# EasyEDA Pro project ProPrj_F411CEU6_917_2025-09-26.epro

# Schematic Schematic1
Board Name: Board1; Create Date: 2025-09-17; Page Name: P1; Project Name: F411CEU6_917; Schematic Name: Schematic1; Update Date: 2025-09-26; Company: 嘉立创EDA; Page Size: A4; Version: V1.0
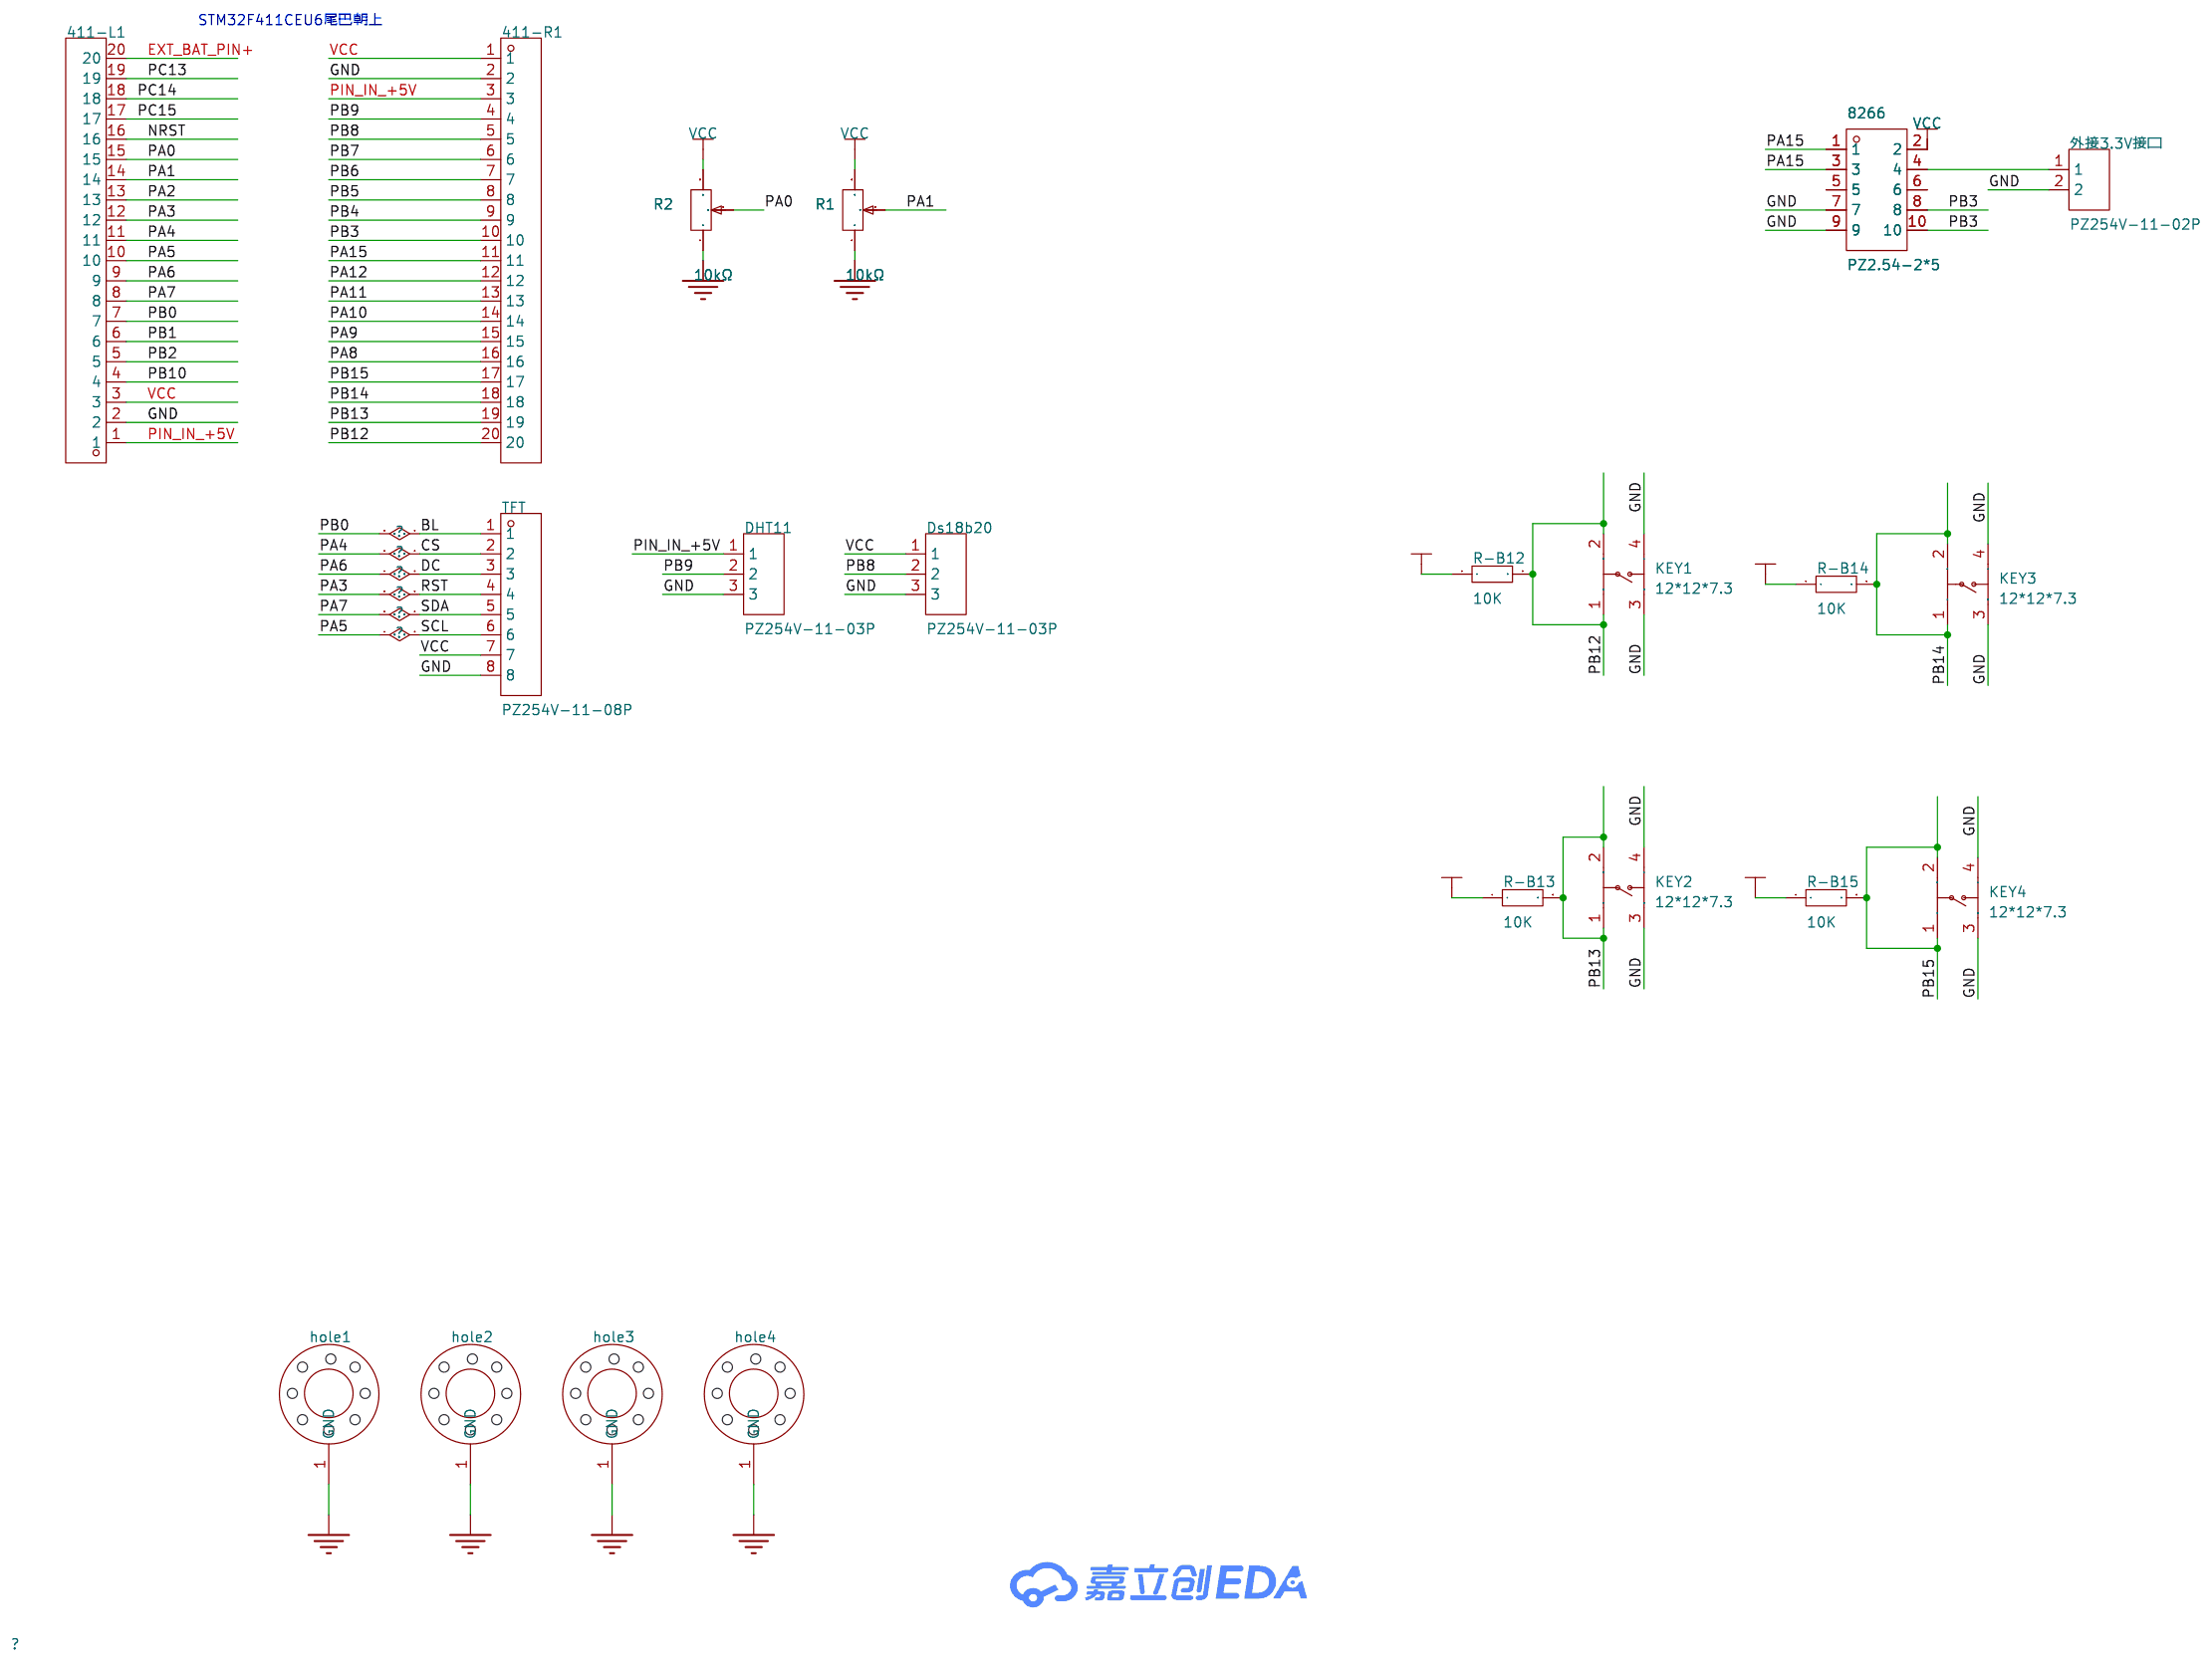
[diagram p0: schematic sheet]

## Parts
411-L1  -  [HDR-TH_20P-P2.54-V-M-1]
411-R1  -  [HDR-TH_20P-P2.54-V-M-1]
8266  PZ2.54-2*5  [HDR-TH_10P-P2.54-V-M-R2-C5-S2.54-1]
DHT11  PZ254V-11-03P  [HDR-TH_3P-P2.54-V-M]
Ds18b20  PZ254V-11-03P  [HDR-TH_3P-P2.54-V-M]
hole1  M3  [m3 125x300]
hole2  M3  [m3 125x300]
hole3  M3  [m3 125x300]
hole4  M3  [m3 125x300]
KEY1  12*12*7.3  [KEY-SMD_4P-L12.0-W12.0-P5.00-LS15.4]
KEY2  12*12*7.3  [KEY-SMD_4P-L12.0-W12.0-P5.00-LS15.4]
KEY3  12*12*7.3  [KEY-SMD_4P-L12.0-W12.0-P5.00-LS15.4]
KEY4  12*12*7.3  [KEY-SMD_4P-L12.0-W12.0-P5.00-LS15.4]
R1  10kΩ  [RES-ADJ-TH_3296W]
R2  10kΩ  [RES-ADJ-TH_3296W]
R-B12  10K  [R0603]
R-B13  10K  [R0603]
R-B14  10K  [R0603]
R-B15  10K  [R0603]
TFT  PZ254V-11-08P  [HDR-TH_8P-P2.54-V-M]
外接3.3V接口  PZ254V-11-02P  [HDR-TH_2P-P2.54-V-M]

## Library data of the parts
411-L1 411-R1 = HDR-M_2.54_1x20P: 间距:2.54mm;总PIN位数:20;排数:1;插针结构:-;行距:-;安装类型:直插;圆针/方针:-;额定电流:-;额定电压:-;配合针长度:-;塑高:-;触头材质:黄铜;触头镀层:-;颜色:黑色;; Supplier Part: C50981; Supplier Footprint: 插件
8266 = PZ2.54-2*5: 插针结构:2x5P;间距:2.54mm;排数:双排;总PIN位数:10P;; Supplier Part: C5156677; Manufacturer: ZHOURI(洲日); Supplier Footprint: 插件,P=2.54mm; JLCPCB Part Class: 扩展库; Datasheet: https://atta.szlcsc.com/upload/public/pdf/source/20220923/FF9D303E4B04AC19FF78D5B876650950.pdf; Supplier: LCSC; Pin Structure: 2x5P; Pitch: 2.54mm; Number of Rows: 双排; Number of Pins: 10P
DHT11 Ds18b20 = PZ254V-11-03P: 插针结构:1x3P;间距:2.54mm;行距:-;圆针/方针:方针;安装方式:直插;排数:单排;总PIN位数:3P;额定电流:3A;额定电压:250V;配合针长度:6mm;塑高:2.5mm;端接针长度:3mm;工作温度:-40℃~+105℃;颜色:黑色;; LCSC Part Name: 1x3P 间距:2.54mm 方针 直插; Supplier Part: C2937625; Manufacturer: XFCN(兴飞); Supplier Footprint: 插件,P=2.54mm; JLCPCB Part Class: 扩展库; Datasheet: https://item.szlcsc.com/datasheet/PZ254V-11-03P/3293280.html; Supplier: LCSC; Pin Structure: 1x3P; Pitch: 2.54mm; Circluar Pins/Square Pins: 方针; Mounting Type: 直插; Number of Rows: 单排; Number of Pins: 3P; Current Rating: 3A; Voltage Rating (Max): 250V; Length of Mating Pin: 6mm; Insulation Height: 2.5mm; Length of End Connection Pin: 3mm; Operating Temperature: -40℃~+105℃; Color: 黑色
hole1-hole4 = m3_梅花螺丝孔: 梅花螺丝孔; Check: false
KEY1-KEY4 = 12*12*7.3: 12*12*7.3贴片方头按键; Supplier Part: C41103; Supplier Footprint: SMD; Supplier: LCSC
R1 R2 = 3296W-1-103LF: 阻值:10kΩ;精度:±10%;功率:500mW;温度系数:±100ppm/℃;; LCSC Part Name: 10kΩ ±10%; Supplier Part: C34846; Manufacturer: BOURNS; Supplier Footprint: SIP-3P,9.5x4.8mm; JLCPCB Part Class: 扩展库; Datasheet: https://atta.szlcsc.com/upload/public/pdf/source/20151026/1457707506403.pdf; Supplier: LCSC; Tolerance: ±10%; Power(Watts): 500mW; Temperature Coefficient: ±100ppm/℃; Turns: 25
R-B12-R-B15 = Res_0603: Supplier Footprint: 0603
TFT = PZ254V-11-08P: 插针结构:1x8P;间距:2.54mm;行距:-;圆针/方针:方针;安装方式:直插;排数:单排;总PIN位数:8P;额定电流:-;额定电压:-;配合针长度:6mm;塑高:2.5mm;端接针长度:3mm;触头材质:黄铜;触头镀层:-;工作温度:-40℃~+105℃;颜色:黑色;; LCSC Part Name: 1x8P 间距:2.54mm 方针 直插; Supplier Part: C492407; Manufacturer: XFCN(兴飞); Supplier Footprint: 插件,P=2.54mm; JLCPCB Part Class: 扩展库; Datasheet: https://item.szlcsc.com/datasheet/PZ254V-11-08P/502963.html; Supplier: LCSC; Pin Structure: 1x8P; Pitch: 2.54mm; Circluar Pins/Square Pins: 方针; Mounting Type: 直插; Number of Rows: 单排; Number of Pins: 8P; Length of Mating Pin: 6mm; Insulation Height: 2.5mm; Length of End Connection Pin: 3mm; Contact Material: 黄铜; Operating Temperature: -40℃~+105℃; Color: 黑色
外接3.3V接口 = PZ254V-11-02P: 插针结构:1x2P;间距:2.54mm;行距:-;圆针/方针:方针;安装方式:直插;排数:单排;总PIN位数:2P;额定电流:-;额定电压:-;配合针长度:6mm;塑高:2.5mm;端接针长度:3mm;触头材质:黄铜;触头镀层:-;工作温度:-40℃~+105℃;颜色:黑色;; LCSC Part Name: 1x2P 间距:2.54mm 方针 直插; Supplier Part: C492401; Manufacturer: XFCN(兴飞); Supplier Footprint: 插件,P=2.54mm; JLCPCB Part Class: 扩展库; Datasheet: https://item.szlcsc.com/datasheet/PZ254V-11-02P/502957.html; Supplier: LCSC; Pin Structure: 1x2P; Pitch: 2.54mm; Circluar Pins/Square Pins: 方针; Mounting Type: 直插; Number of Rows: 单排; Number of Pins: 2P; Length of Mating Pin: 6mm; Insulation Height: 2.5mm; Length of End Connection Pin: 3mm; Contact Material: 黄铜; Operating Temperature: -40℃~+105℃; Color: 黑色

## Nets
GND: 411-L1.2 411-R1.2 8266.7 8266.9 DHT11.3 Ds18b20.3 hole1.1(GND) hole2.1(GND) hole3.1(GND) hole4.1(GND) KEY1.3 KEY1.4 KEY2.3 KEY2.4 KEY3.3 KEY3.4 KEY4.3 KEY4.4 R1.1 R2.1 TFT.8 外接3.3V接口.2
VCC: 411-L1.3 411-R1.1 8266.2 Ds18b20.1 R1.3 R2.3 R-B12.1 R-B13.1 R-B14.1 R-B15.1 TFT.7
BL: 411-L1.7 TFT.1
CS: 411-L1.11 TFT.2
DC: 411-L1.9 TFT.3
EXT_BAT_PIN+: 411-L1.20
NRST: 411-L1.16
PA0: 411-L1.15 R2.2
PA1: 411-L1.14 R1.2
PA2: 411-L1.13
PA3: 411-L1.12 TFT.4
PA5: 411-L1.10 TFT.6
PA7: 411-L1.8 TFT.5
PA8: 411-R1.16
PA9: 411-R1.15
PA10: 411-R1.14
PA11: 411-R1.13
PA12: 411-R1.12
PA15: 411-R1.11 8266.1 8266.3
PB1: 411-L1.6
PB2: 411-L1.5
PB3: 411-R1.10 8266.8 8266.10
PB4: 411-R1.9
PB5: 411-R1.8
PB6: 411-R1.7
PB7: 411-R1.6
PB8: 411-R1.5 Ds18b20.2
PB9: 411-R1.4 DHT11.2
PB10: 411-L1.4
PB12: 411-R1.20 KEY1.1 KEY1.2 R-B12.2
PB13: 411-R1.19 KEY2.1 KEY2.2 R-B13.2
PB14: 411-R1.18 KEY3.1 KEY3.2 R-B14.2
PB15: 411-R1.17 KEY4.1 KEY4.2 R-B15.2
PC13: 411-L1.19
PC14: 411-L1.18
PC15: 411-L1.17
PIN_IN_+5V: 411-L1.1 411-R1.3 DHT11.1
$1N3416: 8266.4 外接3.3V接口.1

Not connected (* = marked no-connect by the designer): 8266 5 6

## Notes on the sheet
- STM32F411CEU6尾巴朝上

# Board PCB1
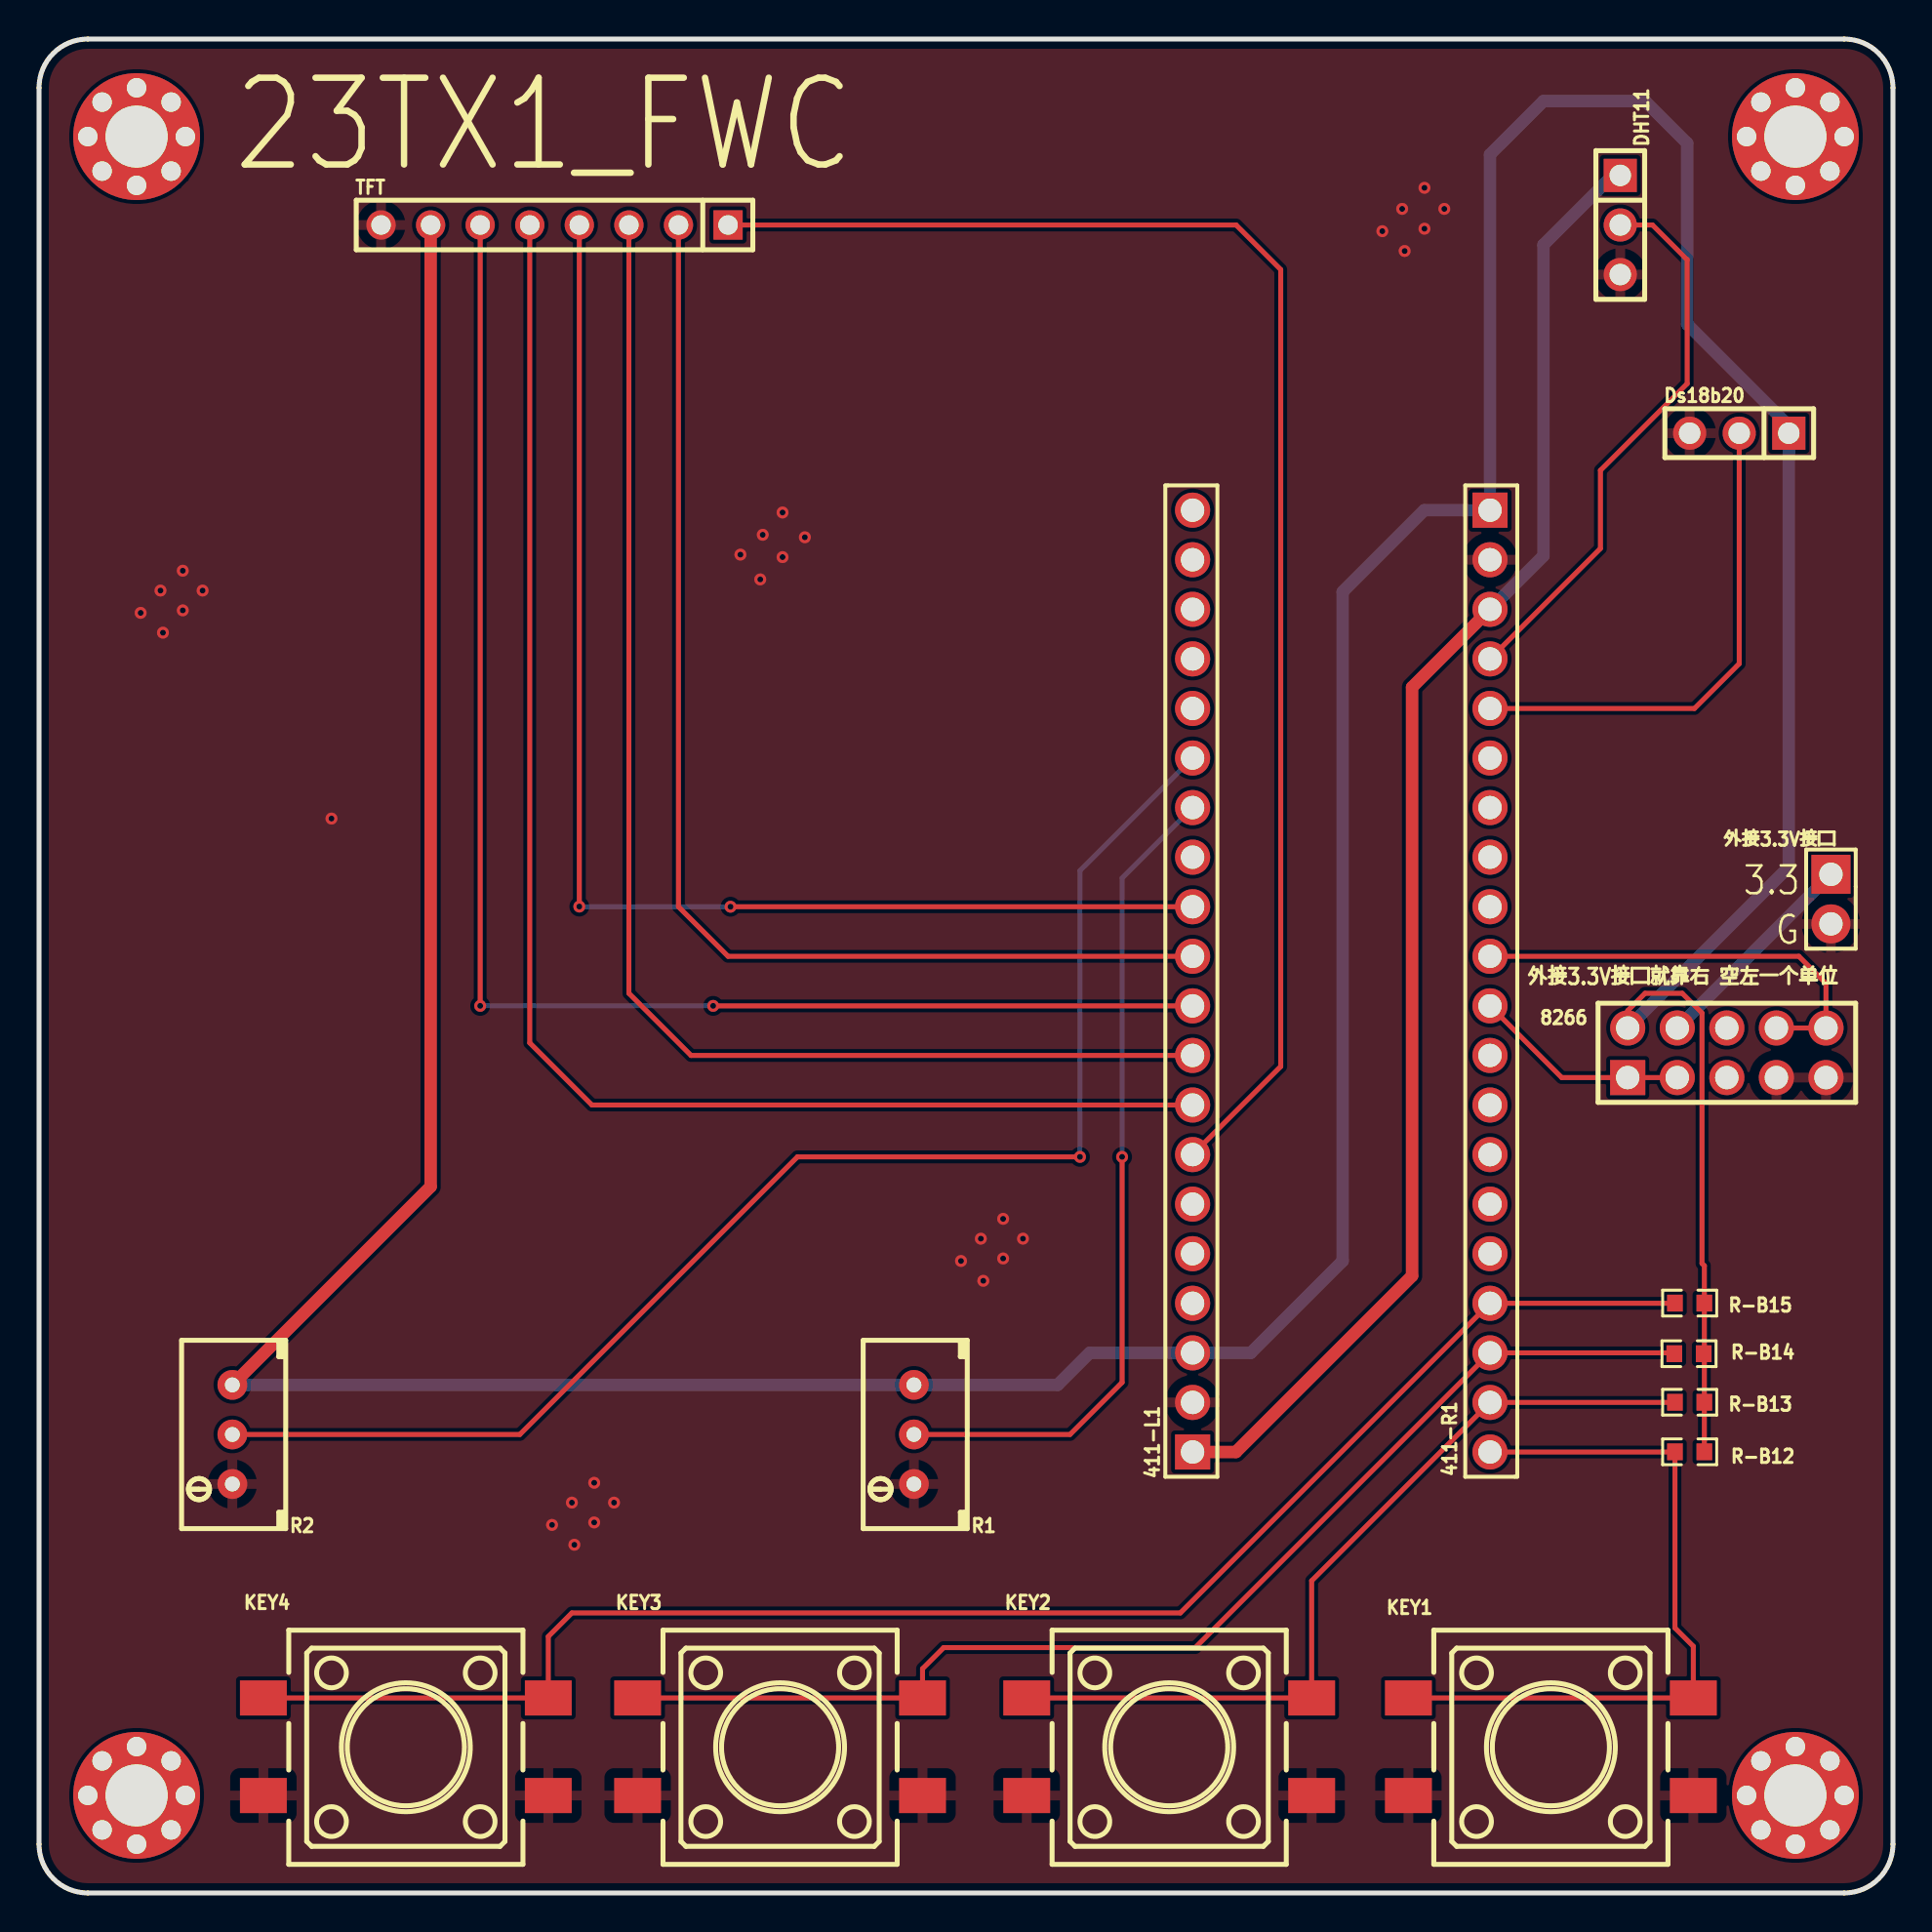
[diagram p1: board, top side]
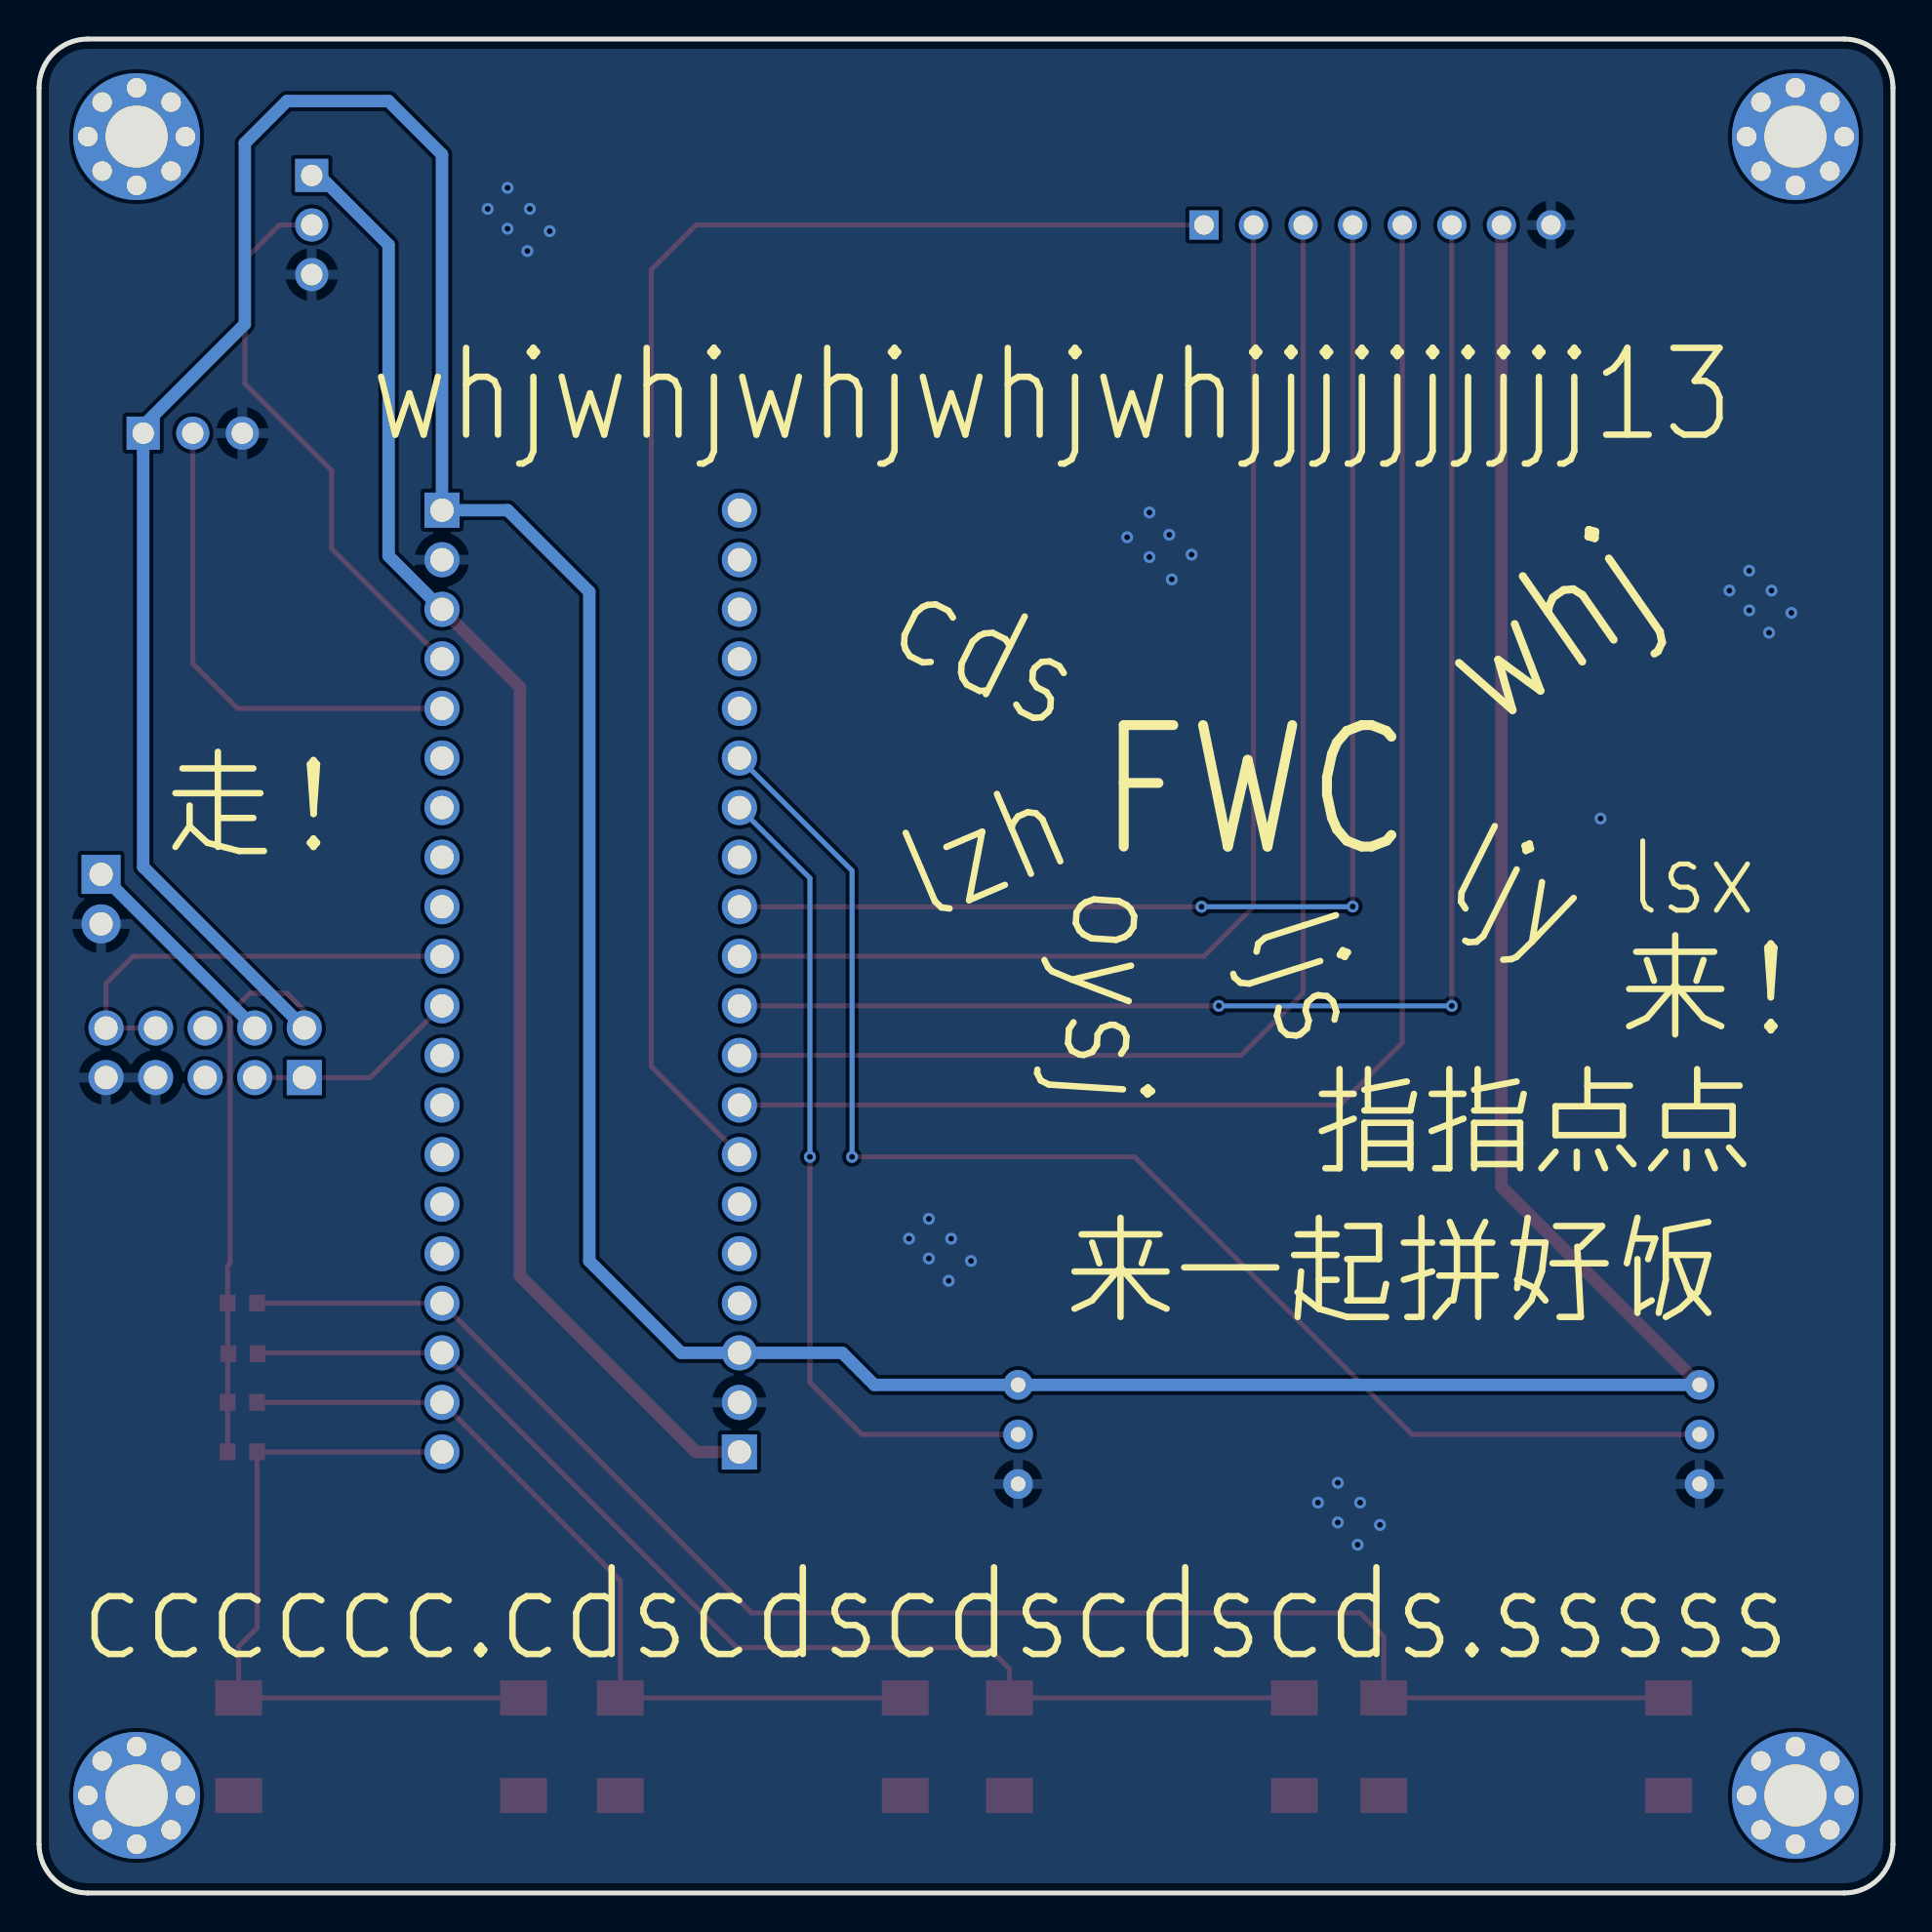
[diagram p2: board, bottom side, seen from below]

Outline 95 x 95 mm; copper layers: Top Layer, Bottom Layer. Coordinates in mm from the lower left corner of the outline.
Outline path: 0,92.5 0,2.5 arc(0.73,0.73) 2.5,0 92.5,0 arc(94.27,0.73) 95,2.5 95,92.5 arc(94.27,94.27) 92.5,95 2.5,95 arc(0.73,94.27) 0,92.5
Stack: Top Layer 0.035mm / Dielectric1 1.51mm FR4 er 4.5 / Bottom Layer 0.035mm

## Design rules (mm)
template: JLCPCB Capability(Two Layers Board)
spacing copperThickness1oz (default): track to track 0.102, other pairs 0.152 to 0.3
spacing copperThickness2oz: track to track 0.203, other pairs 0.152 to 0.3
track width copperThickness1oz (default): min 0.127, default 0.254, max 2.54
track width copperThickness2oz: min 0.203, default 0.254, max 2.54
differential pair differentialPair (default): width min 0.127, default 0.254, max 2.54; gap min 0.152, default 0.152
via viaSize (default): diameter min 0.5, default 0.61, max 10; hole min 0.3, default 0.305, max 6.3

## Placement (name value [footprint] x y rotation side)
411-L1  -  [HDR-TH_20P-P2.54-V-M-1]  59.11 46.73 90 top
411-R1  -  [HDR-TH_20P-P2.54-V-M-1]  74.35 46.73 270 top
8266  PZ2.54-2*5  [HDR-TH_10P-P2.54-V-M-R2-C5-S2.54-1]  86.49 43.05 0 top
DHT11  PZ254V-11-03P  [HDR-TH_3P-P2.54-V-M]  81.03 85.47 270 top
Ds18b20  PZ254V-11-03P  [HDR-TH_3P-P2.54-V-M]  87.12 74.8 180 top
hole1  M3  [m3 125x300]  5 5 0 top
hole2  M3  [m3 125x300]  5 90 0 top
hole3  M3  [m3 125x300]  90 90 0 top
hole4  M3  [m3 125x300]  90 5 0 top
KEY1  12*12*7.3  [KEY-SMD_4P-L12.0-W12.0-P5.00-LS15.4]  77.47 7.49 0 top
KEY2  12*12*7.3  [KEY-SMD_4P-L12.0-W12.0-P5.00-LS15.4]  57.91 7.49 0 top
KEY3  12*12*7.3  [KEY-SMD_4P-L12.0-W12.0-P5.00-LS15.4]  37.97 7.49 0 top
KEY4  12*12*7.3  [KEY-SMD_4P-L12.0-W12.0-P5.00-LS15.4]  18.8 7.49 0 top
R1  10kΩ  [RES-ADJ-TH_3296W]  44.83 23.5 180 top
R2  10kΩ  [RES-ADJ-TH_3296W]  9.91 23.5 180 top
R-B12  10K  [R0603]  84.58 22.61 180 top
R-B13  10K  [R0603]  84.58 25.15 180 top
R-B14  10K  [R0603]  84.55 27.63 180 top
R-B15  10K  [R0603]  84.58 30.23 180 top
TFT  PZ254V-11-08P  [HDR-TH_8P-P2.54-V-M]  26.42 85.47 180 top
外接3.3V接口  PZ254V-11-02P  [HDR-TH_2P-P2.54-V-M]  91.82 50.93 270 top

## Footprints (pads in the part's own frame, mm; a bottom-side part is the same pattern mirrored in y, then rotated)
HDR-TH_2P-P2.54-V-M
  rect 2x2 hole 1.2: 1(-1.27,0)
  round 2 hole 1.2: 2(1.27,0)
HDR-TH_3P-P2.54-V-M
  rect 1.7x1.7 hole 1.1: 1(-2.54,0)
  round 1.7 hole 1.1: 2(0,0) 3(2.54,0)
HDR-TH_8P-P2.54-V-M
  rect 1.5x1.5 hole 1: 1(-8.89,0)
  round 1.5 hole 1: 2(-6.35,0) 3(-3.81,0) 4(-1.27,0) 5(1.27,0) 6(3.81,0) 7(6.35,0) 8(8.89,0)
HDR-TH_10P-P2.54-V-M-R2-C5-S2.54-1
  rect 1.8x1.8 hole 1.2: 1(-5.08,-1.27)
  round 1.8 hole 1.2: 2(-5.08,1.27) 3(-2.54,-1.27) 4(-2.54,1.27) 5(0,-1.27) 6(0,1.27) 7(2.54,-1.27) 8(2.54,1.27) 9(5.08,-1.27) 10(5.08,1.27)
HDR-TH_20P-P2.54-V-M-1
  rect 1.8x1.8 hole 1.2: 1(-24.13,0)
  round 1.8 hole 1.2: 2(-21.59,0) 3(-19.05,0) 4(-16.51,0) 5(-13.97,0) 6(-11.43,0) 7(-8.89,0) 8(-6.35,0) 9(-3.81,0) 10(-1.27,0) 11(1.27,0) 12(3.81,0) 13(6.35,0) 14(8.89,0) 15(11.43,0) 16(13.97,0) 17(16.51,0) 18(19.05,0) 19(21.59,0) 20(24.13,0)
KEY-SMD_4P-L12.0-W12.0-P5.00-LS15.4
  rect 2.4x1.8 smd: 1(-7.3,2.5) 2(7.3,2.5) 3(-7.3,-2.5) 4(7.3,-2.5)
m3 125x300
  round 1 hole 1: 1(-2.5,0) 1(-1.768,1.768) 1(-1.768,-1.768) 1(0,2.5) 1(0,-2.5) 1(1.768,1.768) 1(2.5,0)
  round 6.5 hole 3.18x3.175: 1(0,0)
  round 1 hole 1.021x1: 1(1.768,-1.768)
R0603
  rect 0.806x0.864 smd: 1(-0.753,0) 2(0.753,0)
RES-ADJ-TH_3296W
  round 1.524 hole 0.762: 1(0,2.54) 2(0,0) 3(0,-2.54)

## Nets
As in the schematic.

Pads without a net: 8266 5 6

## Via types
v1: diameter 0.61, hole 0.305, Top Layer to Bottom Layer, 37 vias

## Routing (per net, layer and track width the routed paths; a pad name or vN(x,y) marks a point on that pad's centre or on a via; arc(x,y) is an arc through that point)
GND:
  vias: v1(5.21,65.6) v1(6.22,66.74) v1(6.35,64.58) v1(7.37,67.75) v1(7.37,65.72) v1(8.38,66.74) v1(14.99,55.05) v1(26.29,18.86) v1(27.31,20) v1(27.43,17.84) v1(28.45,21.02) v1(28.45,18.99) v1(29.46,20) v1(35.94,68.58) v1(36.96,67.31) v1(37.08,69.6) v1(38.1,70.74) v1(38.1,68.45) v1(39.24,69.47) v1(47.24,32.39) v1(48.26,33.53) v1(48.39,31.37) v1(49.4,34.54) v1(49.4,32.51) v1(50.42,33.53) v1(68.83,85.15) v1(69.85,86.3) v1(69.98,84.14) v1(70.99,87.38) v1(70.99,85.28) v1(72.01,86.3)
VCC: length 276
  Top Layer w0.254: R-B12.1 R-B13.1 R-B15.1 85.34,32.14 85.22,32.26 85.22,45.09 84.2,46.1 82.3,46.1 81.41,45.21 81.41,44.32
  Top Layer w0.635: TFT.7 20.07,36.19 R2.3
  Bottom Layer w0.635: R2.3 R1.3 52.2,26.03 53.84,27.68 411-L1.3 62.09,27.68 66.8,32.39 66.8,66.67 70.98,70.86 411-R1.1 74.35,89.08 77.09,91.82 82.3,91.82 84.46,89.66 84.46,80.39 89.66,75.18 89.66,52.58 81.41,44.32
BL: length 76.5
  Top Layer w0.254: 411-L1.7 63.63,42.35 63.63,83.19 61.34,85.47 TFT.1
CS: length 62.3
  Top Layer w0.254: TFT.2 32.77,50.54 35.31,48 411-L1.11
DC: length 69.6
  Top Layer w0.254: TFT.3 30.23,46.1 33.41,42.92 411-L1.9
PA0: length 72.2
  Top Layer w0.254: R2.2 24.64,23.5 38.86,37.72 v1(53.34,37.72)
  Bottom Layer w0.254: 59.11,58.16 53.34,52.39 v1(53.34,37.72)
PA1: length 42.7
  Top Layer w0.254: v1(55.5,37.72) 55.5,26.16 52.83,23.5 R1.2
  Bottom Layer w0.254: 411-L1.14 55.5,52 v1(55.5,37.72)
PA3: length 66.4
  Top Layer w0.254: 411-L1.12 v1(35.43,50.54) ; v1(27.69,50.55) TFT.4
  Bottom Layer w0.254: v1(27.69,50.55) 27.69,50.54 v1(35.43,50.54)
PA5: length 76.5
  Top Layer w0.254: v1(22.61,45.46) TFT.6 ; 59.11,45.46 v1(34.54,45.46)
  Bottom Layer w0.254: v1(34.54,45.46) v1(22.61,45.46)
PA7: length 77.2
  Top Layer w0.254: TFT.5 25.15,43.56 28.33,40.38 59.11,40.38
PA15: length 11.1
  Top Layer w0.254: 74.35,45.46 78.03,41.78 8266.3
PB3: length 22.6
  Top Layer w0.254: 411-R1.10 90.18,48 91.57,46.61 8266.10 8266.8
PB8: length 25.5
  Top Layer w0.254: Ds18b20.2 87.12,62.99 84.83,60.7 411-R1.5
PB9: length 28.8
  Top Layer w0.254: 74.35,63.24 80.01,68.9 80.01,72.9 84.46,77.34 84.46,83.69 82.68,85.47 DHT11.2
PB12: length 37.1
  Top Layer w0.254: KEY1.1 KEY1.2 84.77,12.64 83.83,13.58 R-B12.2 83.82,22.6 74.35,22.6
PB13: length 43
  Top Layer w0.254: KEY2.1 KEY2.2 65.21,16 411-R1.19 83.82,25.14 R-B13.2
PB14: length 61.3
  Top Layer w0.254: KEY3.1 45.27,9.99 45.27,11.49 46.35,12.57 59.25,12.57 411-R1.18 83.75,27.68 R-B14.2
PB15: length 82.6
  Top Layer w0.254: R-B15.2 83.82,30.22 411-R1.17 58.49,14.35 27.31,14.35 26.1,13.14 KEY4.2 KEY4.1
PIN_IN_+5V: length 76
  Top Layer w0.635: 59.11,22.6 61.33,22.6 70.36,31.62 70.36,61.78 411-R1.3
  Bottom Layer w0.635: 411-R1.3 77.09,68.52 77.09,84.45 80.65,88.01 DHT11.1
$1N3416: length 11.1
  Bottom Layer w0.635: 8266.4 外接3.3V接口.1

## Copper pours and planes (outline as drawn; the poured copper is in the pictures)
GND on Top Layer: -16.51,115.19 108.59,115.19 108.59,-4.06 -16.51,-4.06
GND on Bottom Layer: -21.84,98.3 114.94,98.3 114.94,-16.89 -21.84,-16.89

## Text on the board
Bottom Silkscreen Layer: lsx | lzh | whjwhjwhjwhjwhjjjjjjjjjj13 | cccccc.cdscdscdscdscds.sssss | ljy | cds | ljs | oysj | whj | FWC | 来！ | 指指点点 | 来一起拼好饭 | 走！
Top Silkscreen Layer: 3.3 | G | 23TX1_FWC | 外接3.3V接口就靠右 空左一个单位
